# Altium schematic sheet HV_BMS_Slave.SchDoc: HV_BMS_Slave1
size A4; Revision: V1.0; SheetNumber: 1; SheetTotal: 6
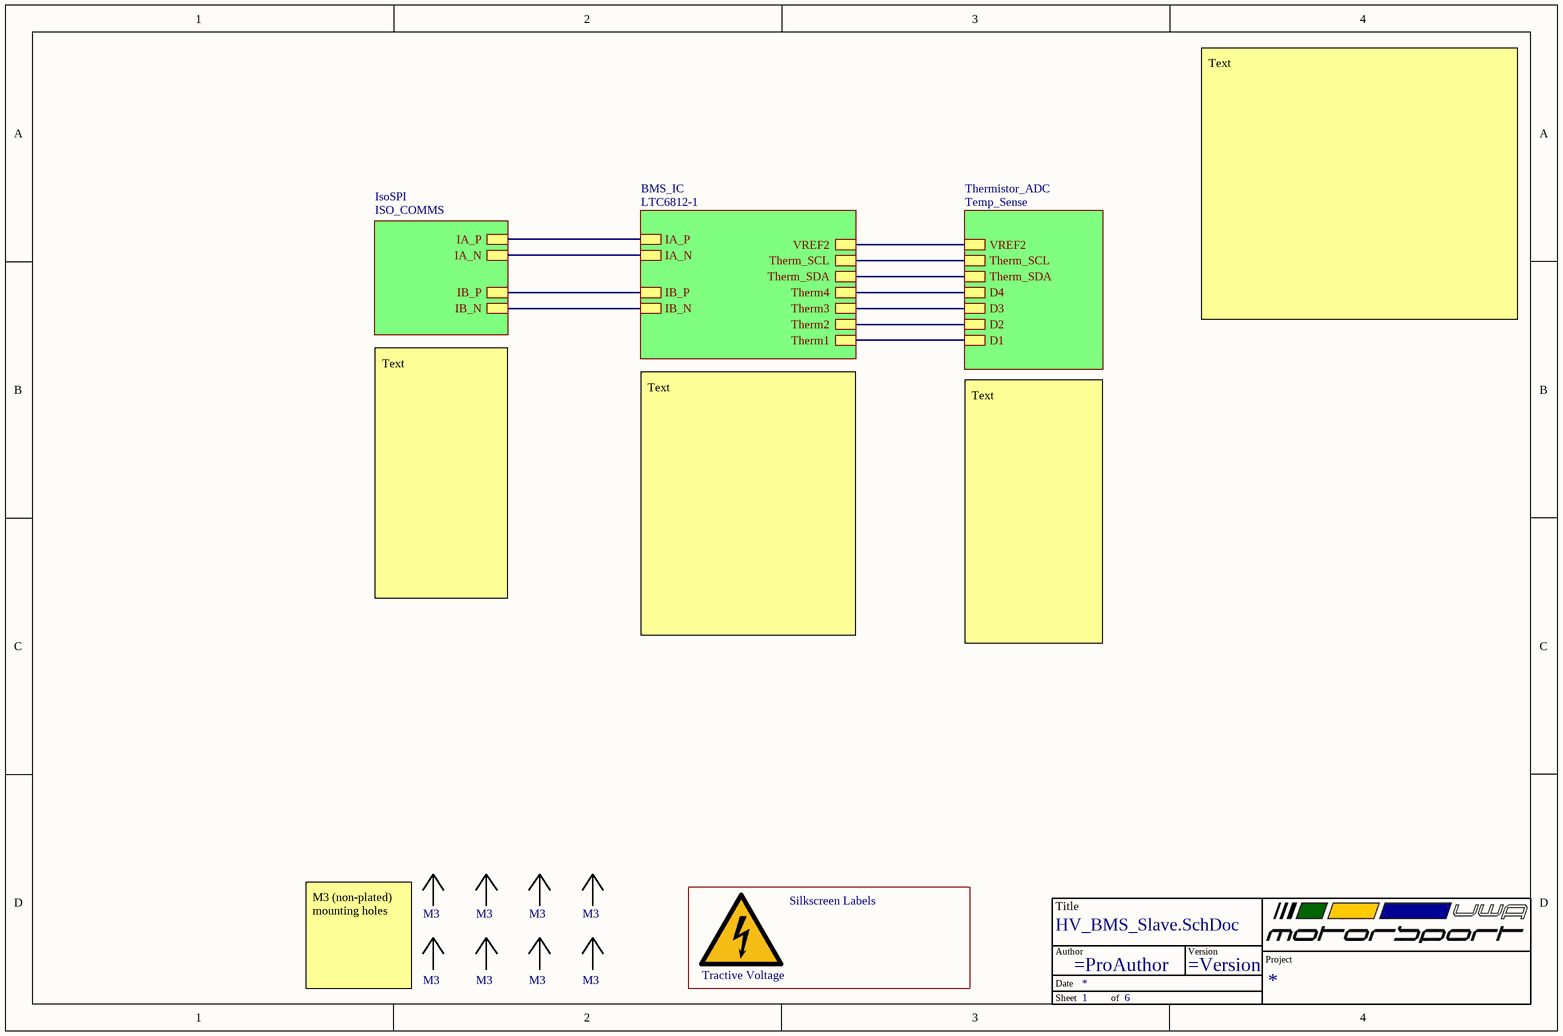
[diagram p0: HV_BMS_Slave.SchDoc]

## Parts
(Parts that share a designator on the sheet are numbered #1, #2 ... from top to bottom, then left to right.)
1  UWAM Logo  [UWAM Logo]  (value not drawn)  (no BOM)
*  TitleBlock  (value not drawn)  (graphical)
?  Tractive voltage symbol  [Tractive voltage]  (value not drawn)  (no BOM)
M3#1  M3 Mounting Holes  [M3 MH]  (value not drawn)  (no BOM)
M3#2  M3 Mounting Holes  [M3 MH]  (value not drawn)  (no BOM)
M3#3  M3 Mounting Holes  [M3 MH]  (value not drawn)  (no BOM)
M3#4  M3 Mounting Holes  [M3 MH]  (value not drawn)  (no BOM)
M3#5  M3 Mounting Holes  [M3 MH]  (value not drawn)  (no BOM)
M3#6  M3 Mounting Holes  [M3 MH]  (value not drawn)  (no BOM)
M3#7  M3 Mounting Holes  [M3 MH]  (value not drawn)  (no BOM)
M3#8  M3 Mounting Holes  [M3 MH]  (value not drawn)  (no BOM)

## Blocks framed on the sheet
Silkscreen Labels: 1 ?

## Sub-sheets
BMS_IC = LTC6812-1: IA_N, IA_P, IB_N, IB_P, Therm2, Therm3, Therm4, Therm1, Therm_SCL, Therm_SDA, VREF2
IsoSPI = ISO_COMMS: IA_N, IA_P, IB_N, IB_P
Thermistor_ADC = Temp_Sense: Therm_SDA, Therm_SCL, D4, D3, D1, D2, VREF2

## Nets
(unnamed): sheet BMS_IC/IA_N, sheet IsoSPI/IA_N
(unnamed): sheet BMS_IC/IA_P, sheet IsoSPI/IA_P
(unnamed): sheet BMS_IC/IB_N, sheet IsoSPI/IB_N
(unnamed): sheet BMS_IC/IB_P, sheet IsoSPI/IB_P
(unnamed): sheet BMS_IC/Therm2, sheet Thermistor_ADC/D2
(unnamed): sheet BMS_IC/Therm3, sheet Thermistor_ADC/D3
(unnamed): sheet BMS_IC/Therm4, sheet Thermistor_ADC/D4
(unnamed): sheet BMS_IC/Therm1, sheet Thermistor_ADC/D1
(unnamed): sheet BMS_IC/Therm_SCL, sheet Thermistor_ADC/Therm_SCL
(unnamed): sheet BMS_IC/Therm_SDA, sheet Thermistor_ADC/Therm_SDA
(unnamed): sheet BMS_IC/VREF2, sheet Thermistor_ADC/VREF2

## Notes on the sheet
- Text
- (near M3#1) M3 (non-plated) mounting holes
- (in symbol TitleBlock) Title; Author; Version; Project; Date; Sheet; of
- (in symbol Tractive voltage symbol) Tractive Voltage